# Altium project ПОприколу.PrjPcb
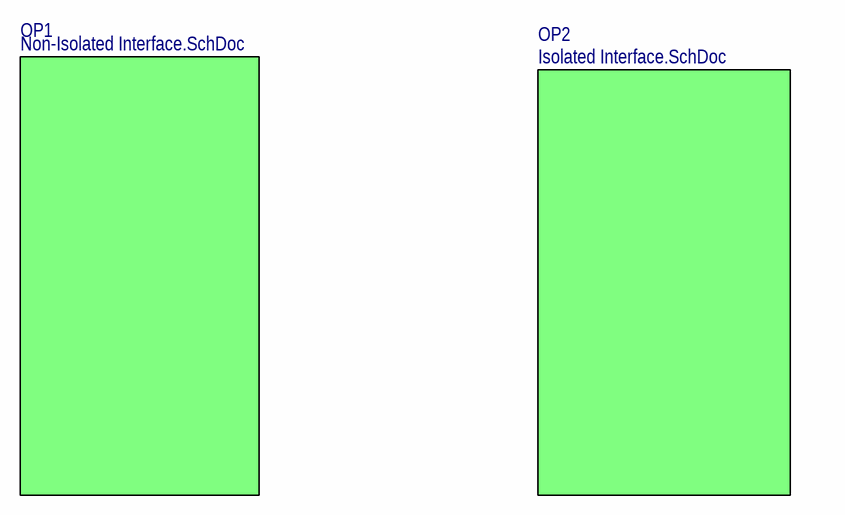
[diagram p0: OptoInterface.SchDoc]
3 sheets, 95 parts. Net scope: global (net labels, ports and power ports of the same name join across sheets).
Board file: PCB3.PcbDoc
Sheets:
  OptoInterface.SchDoc
    OP1 = Non-Isolated Interface.SchDoc
    OP2 = Isolated Interface.SchDoc

## Sheet OptoInterface.SchDoc
size 420 x 297 mm; DocumentNumber: 3; SheetNumber: 1; SheetTotal: 3

### Sub-sheets
OP1 = Non-Isolated Interface.SchDoc: no entries
OP2 = Isolated Interface.SchDoc: no entries

### Notes on the sheet
- Подп. дата
- Инв. № дубл.
- Взам. инв. №
- Подп. и дата
- Инв. № подл.
- Изм.
- Лист
- № докум.
- Подп.
- Дата
- ALTIUM GOSTBOM2.0 KEV
- Файл:
- Копировал
- Формат А3

## Sheet Non-Isolated Interface.SchDoc
size 420 x 297 mm; DocumentNumber: 1; SheetNumber: 2; SheetTotal: 3
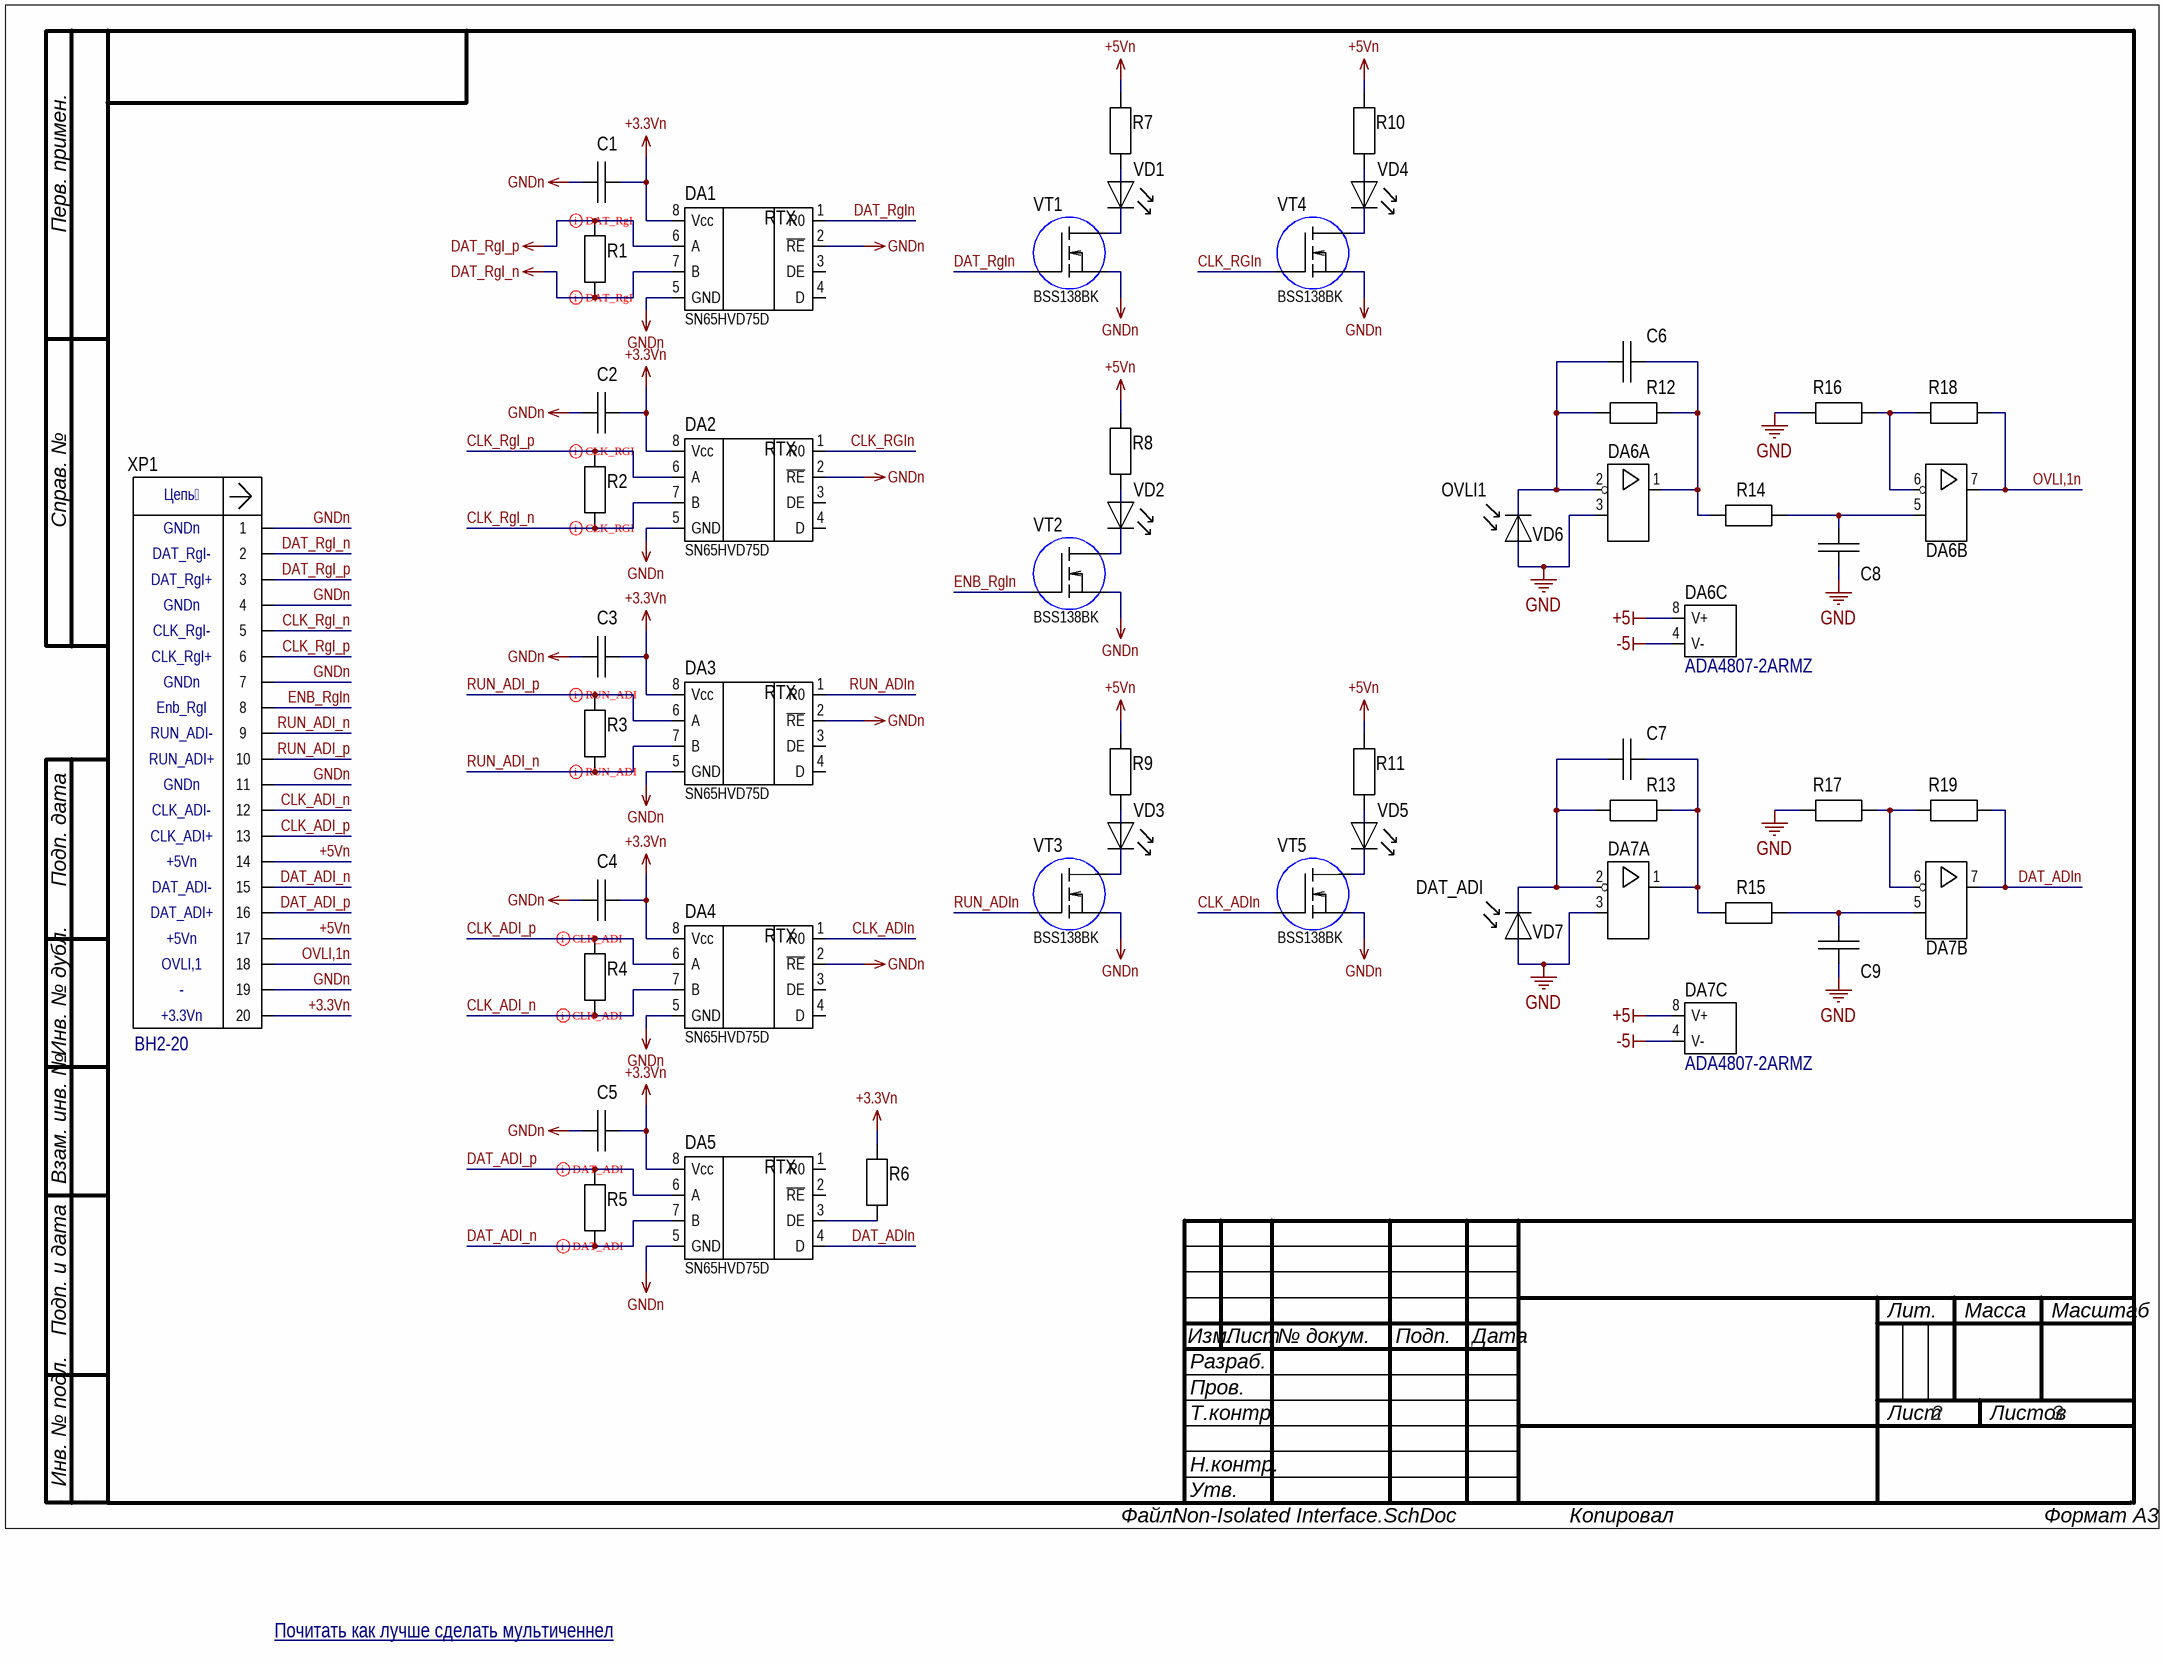
[diagram p1: Non-Isolated Interface.SchDoc]

### Parts
C1  0805-X7R-25 В-0,1 мкФ +-10%  [CAP: 0805]  (value not drawn)
C2  0805-X7R-25 В-0,1 мкФ +-10%  [CAP: 0805]  (value not drawn)
C3  0805-X7R-25 В-0,1 мкФ +-10%  [CAP: 0805]  (value not drawn)
C4  0805-X7R-25 В-0,1 мкФ +-10%  [CAP: 0805]  (value not drawn)
C5  0805-X7R-25 В-0,1 мкФ +-10%  [CAP: 0805]  (value not drawn)
C6  0805-NP0-50 В-2,4 пФ-1%  [CAP: 0805]  (value not drawn)
C7  0805-NP0-50 В-2,4 пФ-1%  [CAP: 0805]  (value not drawn)
C8  1206-С0G-50 B-56 пФ+-1%  [CAP: 1206]  (value not drawn)
C9  1206-С0G-50 B-56 пФ+-1%  [CAP: 1206]  (value not drawn)
DA1  SN65HVD75D  [8-SOIC]
DA2  SN65HVD75D  [8-SOIC]
DA3  SN65HVD75D  [8-SOIC]
DA4  SN65HVD75D  [8-SOIC]
DA5  SN65HVD75D  [8-SOIC]
DA6  ADA4807-2ARMZ  [8-MSOP]  (value not drawn)  (parts A,B,C of 3)
DA7  ADA4807-2ARMZ  [8-MSOP]  (value not drawn)  (parts A,B,C of 3)
R1  1206-100 Ом+-5%  [1206]  (value not drawn)
R2  1206-100 Ом+-5%  [1206]  (value not drawn)
R3  1206-100 Ом+-5%  [1206]  (value not drawn)
R4  1206-100 Ом+-5%  [1206]  (value not drawn)
R5  1206-100 Ом+-5%  [1206]  (value not drawn)
R6  0805-10 KОМ+-5%  [0805]  (value not drawn)
R7  1206-30 Ом+-5%  [1206]  (value not drawn)
R8  1206-30 Ом+-5%  [1206]  (value not drawn)
R9  1206-30 Ом+-5%  [1206]  (value not drawn)
R10  1206-30 Ом+-5%  [1206]  (value not drawn)
R11  1206-30 Ом+-5%  [1206]  (value not drawn)
R12  1206-5,23 кОм+-1%  [1206]  (value not drawn)
R13  1206-5,23 кОм+-1%  [1206]  (value not drawn)
R14  1206-140 Ом+-1%  [1206]  (value not drawn)
R15  1206-140 Ом+-1%  [1206]  (value not drawn)
R16  1206-102 Ом+-1%  [1206]  (value not drawn)
R17  1206-102 Ом+-1%  [1206]  (value not drawn)
R18  1206-215 Ом+-1%  [1206]  (value not drawn)
R19  1206-215 Ом+-1%  [1206]  (value not drawn)
VD1  VSMY2853RG  [VSMY2853G]  (value not drawn)
VD2  VSMY2853RG  [VSMY2853G]  (value not drawn)
VD3  VSMY2853RG  [VSMY2853G]  (value not drawn)
VD4  VSMY2853RG  [VSMY2853G]  (value not drawn)
VD5  VSMY2853RG  [VSMY2853G]  (value not drawn)
VD6  SFH203  [SFH203]  (value not drawn)
VD7  SFH203  [SFH203]  (value not drawn)
VT1  BSS138BK  [SOT-23-3]
VT2  BSS138BK  [SOT-23-3]
VT3  BSS138BK  [SOT-23-3]
VT4  BSS138BK  [SOT-23-3]
VT5  BSS138BK  [SOT-23-3]
XP1  BH2-20  [DS1014-20S]

### Nets
+3.3Vn: C1.2 C2.2 C3.2 C4.2 C5.2 DA1.8(Vcc) DA2.8(Vcc) DA3.8(Vcc) DA4.8(Vcc) DA5.8(Vcc) R6.2 XP1.20
+5: DA6.8(V+) DA7.8(V+)
+5Vn: R7.2 R8.2 R9.2 R10.2 R11.2 XP1.14 XP1.17
-5: DA6.4(V-) DA7.4(V-)
DAT_RgI_n: DA1.7(B) R1.1 XP1.2
DAT_RgI_p: DA1.6(A) R1.2 XP1.3
GND: C8.1 C9.1 DA6.3(+IN_A) DA7.3(+IN_A) R16.1 R17.1 VD6.1 VD7.1
GNDn: C1.1 C2.1 C3.1 C4.1 C5.1 DA1.2(~{RE}) DA1.5(GND) DA2.2(~{RE}) DA2.5(GND) DA3.2(~{RE}) DA3.5(GND) DA4.2(~{RE}) DA4.5(GND) DA5.5(GND) VT1.2(S) VT2.2(S) VT3.2(S) VT4.2(S) VT5.2(S) XP1.1 XP1.4 XP1.7 XP1.11 XP1.19
CLK_ADI_n: DA4.7(B) R4.1 XP1.12
CLK_ADI_p: DA4.6(A) R4.2 XP1.13
CLK_ADIn: DA4.1(R0) VT5.1(G)
CLK_RgI_n: DA2.7(B) R2.1 XP1.5
CLK_RgI_p: DA2.6(A) R2.2 XP1.6
CLK_RGIn: DA2.1(R0) VT4.1(G)
DAT_ADI_n: DA5.7(B) R5.1 XP1.15
DAT_ADI_p: DA5.6(A) R5.2 XP1.16
DAT_ADIn: DA5.4(D) DA7.7(OUT_B) R19.2
DAT_RgIn: DA1.1(R0) VT1.1(G)
ENB_RgIn: VT2.1(G) XP1.8
OVLI,1n: DA6.7(OUT_B) R18.2 XP1.18
RUN_ADI_n: DA3.7(B) R3.1 XP1.9
RUN_ADI_p: DA3.6(A) R3.2 XP1.10
RUN_ADIn: DA3.1(R0) VT3.1(G)
NetC6_1: C6.1 DA6.2(-IN_A) R12.1 VD6.2
NetC6_2: C6.2 DA6.1(OUT_A) R12.2 R14.1
NetC7_1: C7.1 DA7.2(-IN_A) R13.1 VD7.2
NetC7_2: C7.2 DA7.1(OUT_A) R13.2 R15.1
NetC8_2: C8.2 DA6.5(+IN_B) R14.2
NetC9_2: C9.2 DA7.5(+IN_B) R15.2
NetDA5_3: DA5.3(DE) R6.1
NetDA6_6: DA6.6(-IN_B) R16.2 R18.1
NetDA7_6: DA7.6(-IN_B) R17.2 R19.1
NetR7_1: R7.1 VD1.1(Anode)
NetR8_1: R8.1 VD2.1(Anode)
NetR9_1: R9.1 VD3.1(Anode)
NetR10_1: R10.1 VD4.1(Anode)
NetR11_1: R11.1 VD5.1(Anode)
NetVD1_2: VD1.2(Cathode) VT1.3(D)
NetVD2_2: VD2.2(Cathode) VT2.3(D)
NetVD3_2: VD3.2(Cathode) VT3.3(D)
NetVD4_2: VD4.2(Cathode) VT4.3(D)
NetVD5_2: VD5.2(Cathode) VT5.3(D)

Not connected (* = marked no-connect by the designer): DA1 3(DE) 4(D); DA2 3(DE) 4(D); DA3 3(DE) 4(D); DA4 3(DE) 4(D); DA5 1(R0) 2(~{RE})

### Layout directives
differential pair: CLK_ADI_n, CLK_ADI_p, CLK_RgI_n, CLK_RgI_p, DAT_ADI_n, DAT_ADI_p, DAT_RgI_n, DAT_RgI_p, RUN_ADI_n, RUN_ADI_p

### Notes on the sheet
- (near VD6) OVLI1
- GNDn
- (near XP1) DAT_RgI-
- (near XP1) DAT_RgI+
- (near XP1) 1
- (near XP1) 2
- (near XP1) 3
- (near XP1) CLK_RgI-
- (near XP1) 4
- (near XP1) 5
- (near XP1) Enb_RgI
- (near XP1) CLK_RgI+
- (near XP1) 6
- (near XP1) 7
- (near XP1) 8
- (near XP1) RUN_ADI-
- (near XP1) RUN_ADI+
- (near XP1) 9
- (near XP1) 10
- (near XP1) CLK_ADI-
- (near XP1) CLK_ADI+
- (near XP1) 11
- (near XP1) 12
- (near XP1) 13
- +5Vn
- (near XP1) DAT_ADI-
- (near XP1) 14
- (near XP1) 15
- (near VD7) DAT_ADI
- (near XP1) DAT_ADI+
- OVLI,1
- (near XP1) 16
- (near XP1) 17
- (near XP1) 18
- -
- +3.3Vn
- (near XP1) 19
- (near XP1) 20
- Почитать как лучше сделать мультиченнел <https://www.altium.com/ru/documentation/altium-designer/schematic/creating-multi-channel-design?srsltid=AfmBOoowIIgC5oni57reNHnMsLt-gKogXpLBYmzkREkKA0Q0dj4Nk9HQ#ae8f2b5cea890581aea85b89c941a49c>
- Перв. примен.
- Справ. №
- Подп. дата
- Инв. № дубл.
- Взам. инв. №
- Подп. и дата
- Изм.
- Разраб.
- Лист
- № докум.
- Подп.
- Дата
- Лит.
- Масса
- Масштаб
- Пров.
- Т.контр.
- Листов
- Инв. № подл.
- Н.контр.
- Утв.
- ALTIUM GOSTBOM2.0 KEV
- Файл:
- Копировал
- Формат А3
- (in symbol BH2-20) Цепь
- (in symbol SN65HVD75D) RTX

### Library data of the parts
C1-C5 = 0805-X7R-25 В-0,1 мкФ +-10%: Value: 0,1 мкФ
C6 C7 = 0805-NP0-50 В-2,4 пФ-1%: Value: 2,1 мкФ
C8 C9 = 1206-С0G-50 B-56 пФ+-1%: Value: 56 пФ
DA6 DA7 = ADA4807-2ARMZ: 3.1 nV/√Hz, 1 mA, 180 MHz, / Rail-to-Rail Input/Output Amplifiers
R1-R5 = 1206-100 Ом+-5%: Value: 100 Ом; ModelPrint: 1206
R6 = 0805-10 KОМ+-5%: Value: 10 кОм; ModelPrint: 0805
R7-R11 = 1206-30 Ом+-5%: Value: 30 Ом; ModelPrint: 1206
  R8: ClassName: ENB
R14 R15 = 1206-140 Ом+-1%: Value: 140 Ом; ModelPrint: 1206
R16 R17 = 1206-102 Ом+-1%: Value: 102 Ом; ModelPrint: 1206
R18 R19 = 1206-215 Ом+-1%: Value: 215 Ом; ModelPrint: 1206
VD1-VD5 = VSMY2853RG: High Speed Infrared Emitting Diodes, 850 nm, / Surface Emitter Technology
  VD2: ClassName: ENB
VD6 VD7 = SFH203: Silicon PIN Photodiode
VT1-VT5 = BSS138BK: 60 V, 360 mA N-channel Trench MOSFET
  VT2: ClassName: ENB
XP1 = BH2-20: pitch 2mm, 20 pin 2x10; System: Connector
R12 R13 = 1206-5,23 кОм+-1%: ModelPrint: 1206; Value: 5,23 кОм

## Sheet Isolated Interface.SchDoc
size 420 x 297 mm; DocumentNumber: 2; SheetNumber: 3; SheetTotal: 3
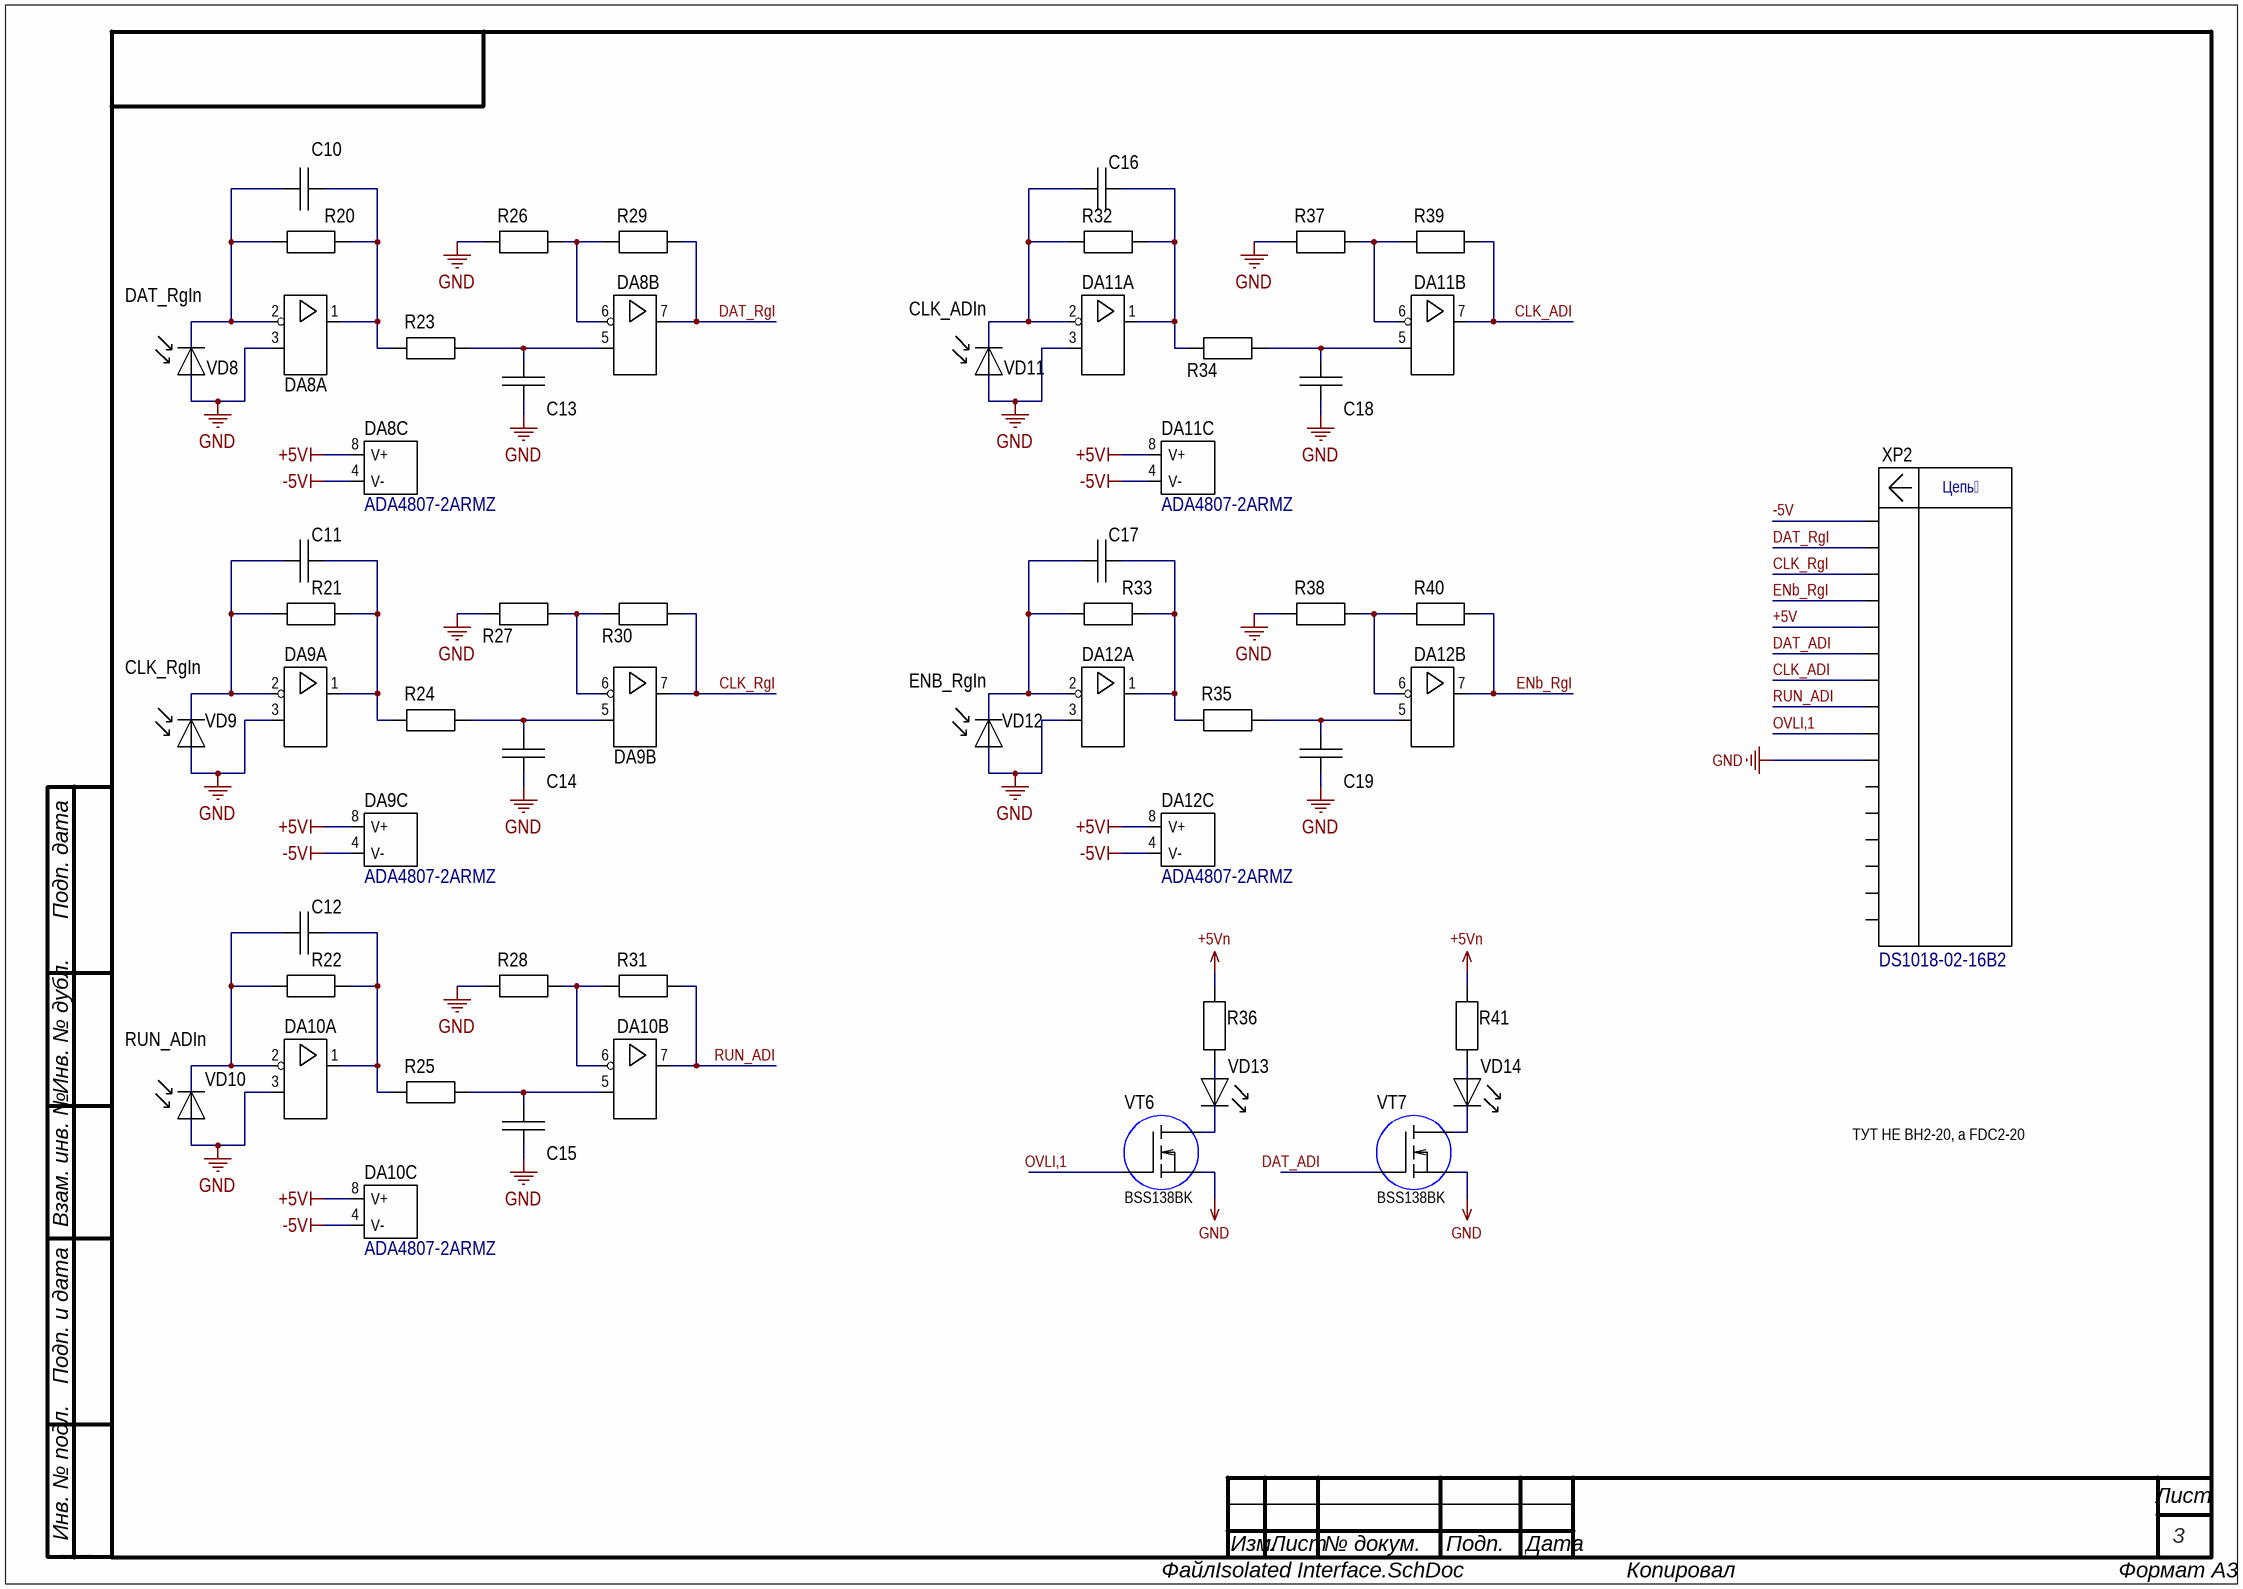
[diagram p2: Isolated Interface.SchDoc]

### Parts
C10  0805-NP0-50 В-2,4 пФ-1%  [CAP: 0805]  (value not drawn)
C11  0805-NP0-50 В-2,4 пФ-1%  [CAP: 0805]  (value not drawn)
C12  0805-NP0-50 В-2,4 пФ-1%  [CAP: 0805]  (value not drawn)
C13  1206-С0G-50 B-56 пФ+-1%  [CAP: 1206]  (value not drawn)
C14  1206-С0G-50 B-56 пФ+-1%  [CAP: 1206]  (value not drawn)
C15  1206-С0G-50 B-56 пФ+-1%  [CAP: 1206]  (value not drawn)
C16  0805-NP0-50 В-2,4 пФ-1%  [CAP: 0805]  (value not drawn)
C17  0805-NP0-50 В-2,4 пФ-1%  [CAP: 0805]  (value not drawn)
C18  1206-С0G-50 B-56 пФ+-1%  [CAP: 1206]  (value not drawn)
C19  1206-С0G-50 B-56 пФ+-1%  [CAP: 1206]  (value not drawn)
DA8  ADA4807-2ARMZ  [8-MSOP]  (value not drawn)  (parts A,B,C of 3)
DA9  ADA4807-2ARMZ  [8-MSOP]  (value not drawn)  (parts A,B,C of 3)
DA10  ADA4807-2ARMZ  [8-MSOP]  (value not drawn)  (parts A,B,C of 3)
DA11  ADA4807-2ARMZ  [8-MSOP]  (value not drawn)  (parts A,B,C of 3)
DA12  ADA4807-2ARMZ  [8-MSOP]  (value not drawn)  (parts A,B,C of 3)
R20  1206-5,23 кОм+-1%  [1206]  (value not drawn)
R21  1206-5,23 кОм+-1%  [1206]  (value not drawn)
R22  1206-5,23 кОм+-1%  [1206]  (value not drawn)
R23  1206-140 Ом+-1%  [1206]  (value not drawn)
R24  1206-140 Ом+-1%  [1206]  (value not drawn)
R25  1206-140 Ом+-1%  [1206]  (value not drawn)
R26  1206-102 Ом+-1%  [1206]  (value not drawn)
R27  1206-102 Ом+-1%  [1206]  (value not drawn)
R28  1206-102 Ом+-1%  [1206]  (value not drawn)
R29  1206-215 Ом+-1%  [1206]  (value not drawn)
R30  1206-215 Ом+-1%  [1206]  (value not drawn)
R31  1206-215 Ом+-1%  [1206]  (value not drawn)
R32  1206-5,23 кОм+-1%  [1206]  (value not drawn)
R33  1206-5,23 кОм+-1%  [1206]  (value not drawn)
R34  1206-140 Ом+-1%  [1206]  (value not drawn)
R35  1206-140 Ом+-1%  [1206]  (value not drawn)
R36  1206-30 Ом+-5%  [1206]  (value not drawn)
R37  1206-102 Ом+-1%  [1206]  (value not drawn)
R38  1206-102 Ом+-1%  [1206]  (value not drawn)
R39  1206-215 Ом+-1%  [1206]  (value not drawn)
R40  1206-215 Ом+-1%  [1206]  (value not drawn)
R41  1206-30 Ом+-5%  [1206]  (value not drawn)
VD8  SFH203  [SFH203]  (value not drawn)
VD9  SFH203  [SFH203]  (value not drawn)
VD10  SFH203  [SFH203]  (value not drawn)
VD11  SFH203  [SFH203]  (value not drawn)
VD12  SFH203  [SFH203]  (value not drawn)
VD13  VSMY2853RG  [VSMY2853G]  (value not drawn)
VD14  VSMY2853RG  [VSMY2853G]  (value not drawn)
VT6  BSS138BK  [SOT-23-3]
VT7  BSS138BK  [SOT-23-3]
XP2  DS1018-02-16B2  [DS1018-02-16B2]

### Nets
+5V: DA8.8(V+) DA9.8(V+) DA10.8(V+) DA11.8(V+) DA12.8(V+) XP2.5
+5Vn: R36.2 R41.2
-5V: DA8.4(V-) DA9.4(V-) DA10.4(V-) DA11.4(V-) DA12.4(V-) XP2.1
GND: C13.1 C14.1 C15.1 C18.1 C19.1 DA8.3(+IN_A) DA9.3(+IN_A) DA10.3(+IN_A) DA11.3(+IN_A) DA12.3(+IN_A) R26.1 R27.1 R28.1 R37.1 R38.1 VD8.1 VD9.1 VD10.1 VD11.1 VD12.1 VT6.2(S) VT7.2(S) XP2.10
CLK_ADI: DA11.7(OUT_B) R39.2 XP2.7
CLK_RgI: DA9.7(OUT_B) R30.2 XP2.3
DAT_ADI: VT7.1(G) XP2.6
DAT_RgI: DA8.7(OUT_B) R29.2 XP2.2
ENb_RgI: DA12.7(OUT_B) R40.2 XP2.4
OVLI,1: VT6.1(G) XP2.9
RUN_ADI: DA10.7(OUT_B) R31.2 XP2.8
NetC10_1: C10.1 DA8.2(-IN_A) R20.1 VD8.2
NetC10_2: C10.2 DA8.1(OUT_A) R20.2 R23.1
NetC11_1: C11.1 DA9.2(-IN_A) R21.1 VD9.2
NetC11_2: C11.2 DA9.1(OUT_A) R21.2 R24.1
NetC12_1: C12.1 DA10.2(-IN_A) R22.1 VD10.2
NetC12_2: C12.2 DA10.1(OUT_A) R22.2 R25.1
NetC13_2: C13.2 DA8.5(+IN_B) R23.2
NetC14_2: C14.2 DA9.5(+IN_B) R24.2
NetC15_2: C15.2 DA10.5(+IN_B) R25.2
NetC16_1: C16.1 DA11.2(-IN_A) R32.1 VD11.2
NetC16_2: C16.2 DA11.1(OUT_A) R32.2 R34.1
NetC17_1: C17.1 DA12.2(-IN_A) R33.1 VD12.2
NetC17_2: C17.2 DA12.1(OUT_A) R33.2 R35.1
NetC18_2: C18.2 DA11.5(+IN_B) R34.2
NetC19_2: C19.2 DA12.5(+IN_B) R35.2
NetDA8_6: DA8.6(-IN_B) R26.2 R29.1
NetDA9_6: DA9.6(-IN_B) R27.2 R30.1
NetDA10_6: DA10.6(-IN_B) R28.2 R31.1
NetDA11_6: DA11.6(-IN_B) R37.2 R39.1
NetDA12_6: DA12.6(-IN_B) R38.2 R40.1
NetR36_1: R36.1 VD13.1(Anode)
NetR41_1: R41.1 VD14.1(Anode)
NetVD13_2: VD13.2(Cathode) VT6.3(D)
NetVD14_2: VD14.2(Cathode) VT7.3(D)

Not connected (* = marked no-connect by the designer): XP2 11 12 13 14 15 16

### Notes on the sheet
- (near VD8) DAT_RgIn
- (near VD11) CLK_ADIn
- (near VD9) CLK_RgIn
- (near VD12) ENB_RgIn
- (near VD10) RUN_ADIn
- ТУТ НЕ BH2-20, а FDC2-20
- Подп. дата
- Инв. № дубл.
- Взам. инв. №
- Подп. и дата
- Инв. № подл.
- Изм.
- Лист
- № докум.
- Подп.
- Дата
- ALTIUM GOSTBOM2.0 KEV
- Файл:
- Копировал
- Формат А3
- (in symbol DS1018-02-16B2) Цепь

### Library data of the parts
C10-C12 C16 C17 = 0805-NP0-50 В-2,4 пФ-1%: Value: 2,1 мкФ
C13-C15 C18 C19 = 1206-С0G-50 B-56 пФ+-1%: Value: 56 пФ
DA8-DA12 = ADA4807-2ARMZ: as DA6 on sheet Non-Isolated Interface
R23-R25 R34 R35 = 1206-140 Ом+-1%: Value: 140 Ом; ModelPrint: 1206
R26-R28 R37 R38 = 1206-102 Ом+-1%: Value: 102 Ом; ModelPrint: 1206
R29-R31 R39 R40 = 1206-215 Ом+-1%: Value: 215 Ом; ModelPrint: 1206
R36 R41 = 1206-30 Ом+-5%: Value: 30 Ом; ModelPrint: 1206
VD8-VD12 = SFH203: Silicon PIN Photodiode
VD13 VD14 = VSMY2853RG: as VD1 on sheet Non-Isolated Interface
VT6 VT7 = BSS138BK: 60 V, 360 mA N-channel Trench MOSFET
XP2 = DS1018-02-16B2: pitch 2mm, 20 pin 2x10
R20-R22 R32 R33 = 1206-5,23 кОм+-1%: ModelPrint: 1206; Value: 5,23 кОм

## Nets that join several sheets
+5Vn: Non-Isolated Interface (7 pins), Isolated Interface (R36.2 R41.2)
GND: Non-Isolated Interface (8 pins), Isolated Interface (23 pins)